# EasyEDA Pro project ProPrj_ProDoc_Board_AI8051U_20240829A_2024-08-30.epro, schematic Schematic_20240829A, sheets 3 to 5 of 6

## Sheets
3 P3
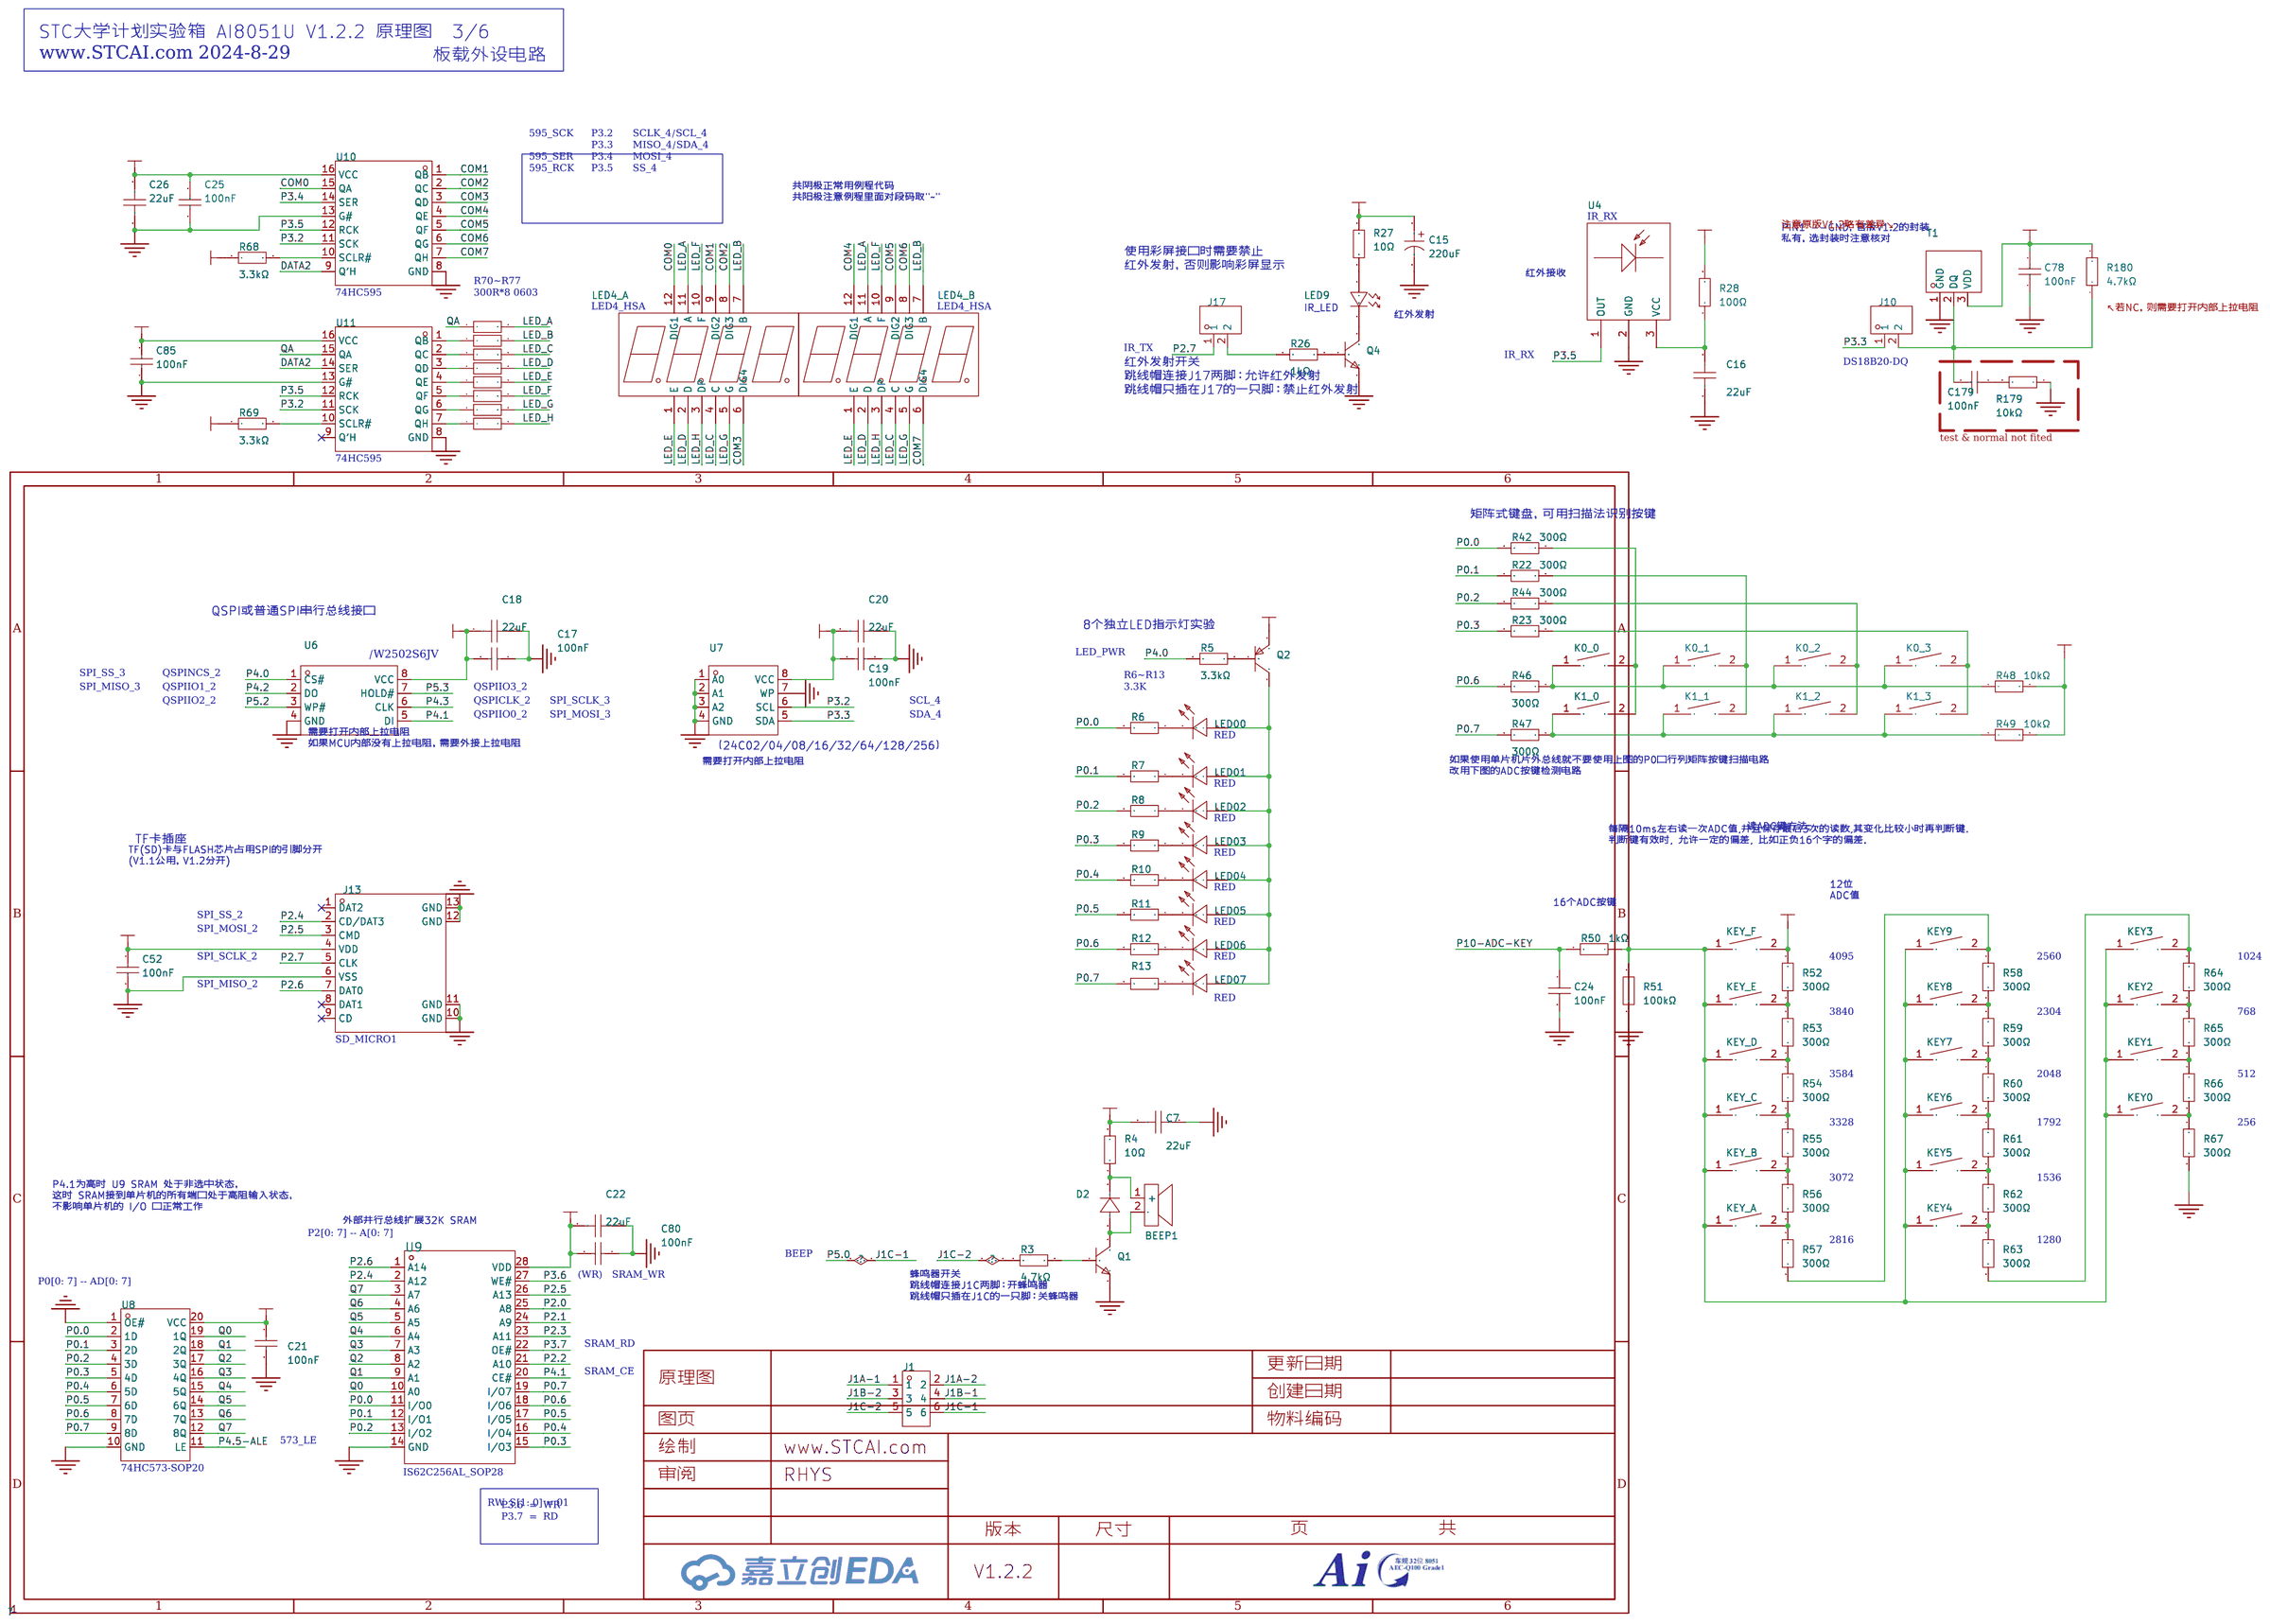
[diagram p2: P3]
4 P4
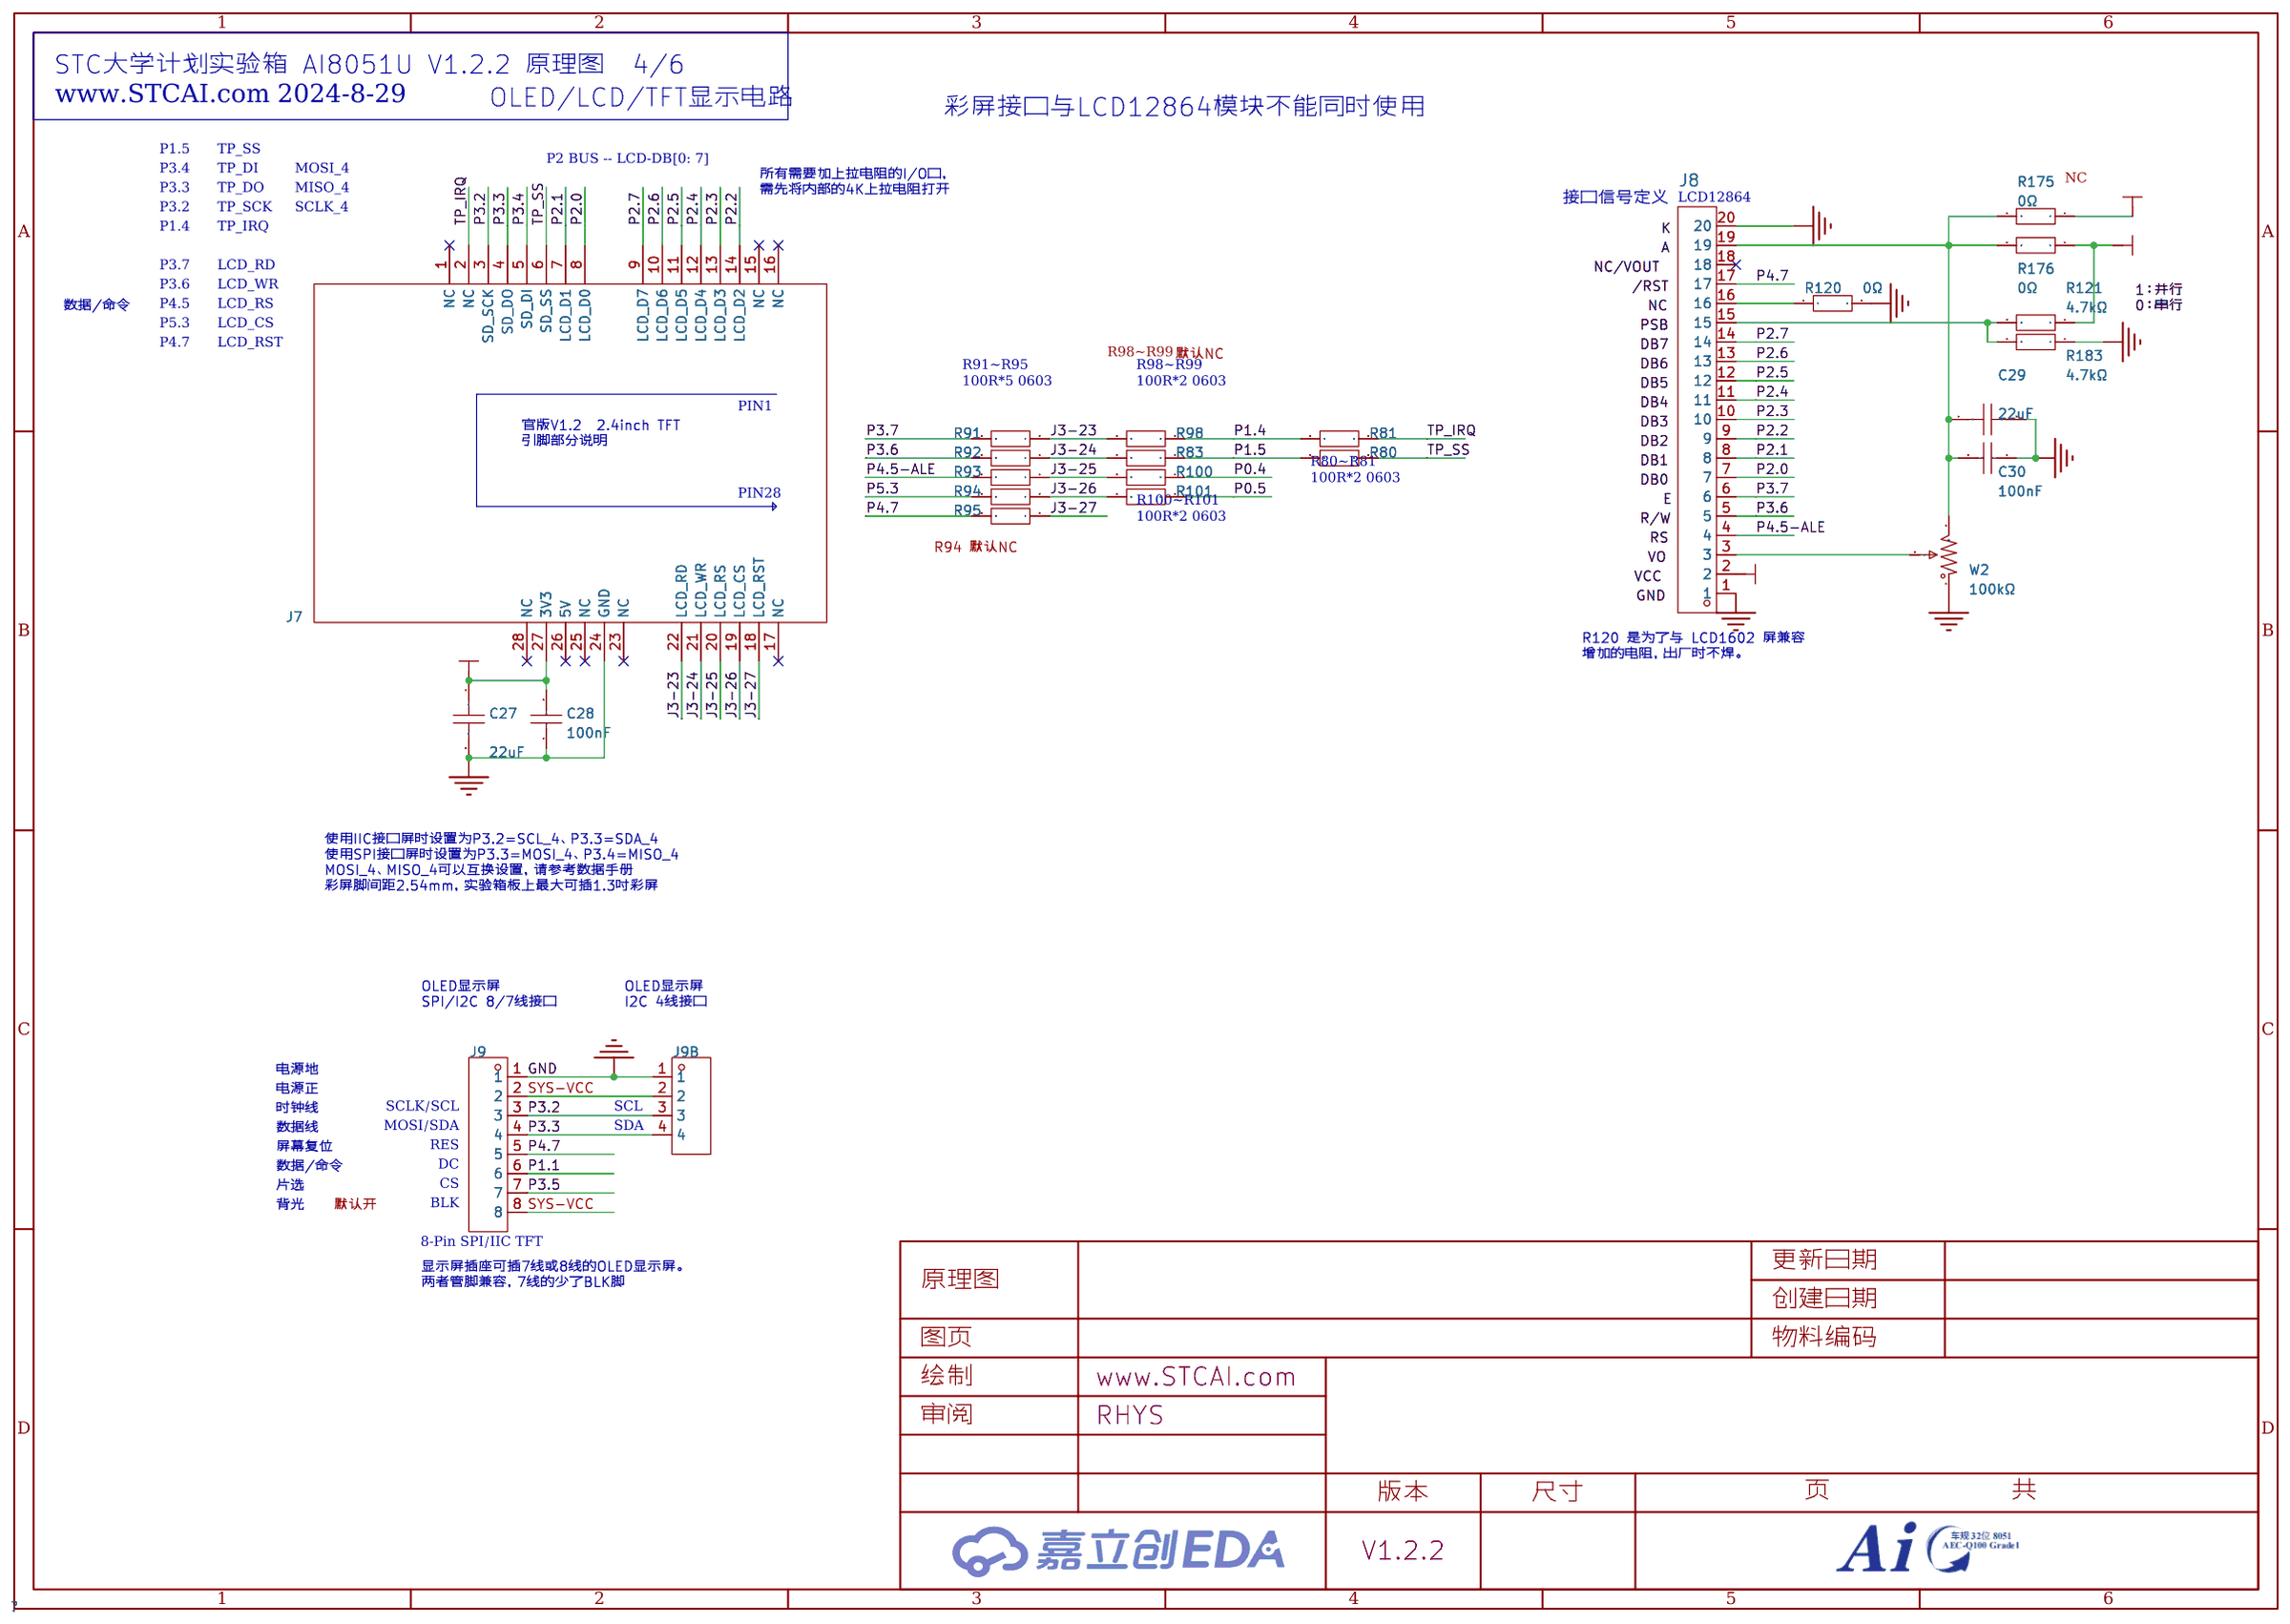
[diagram p3: P4]
5 P5
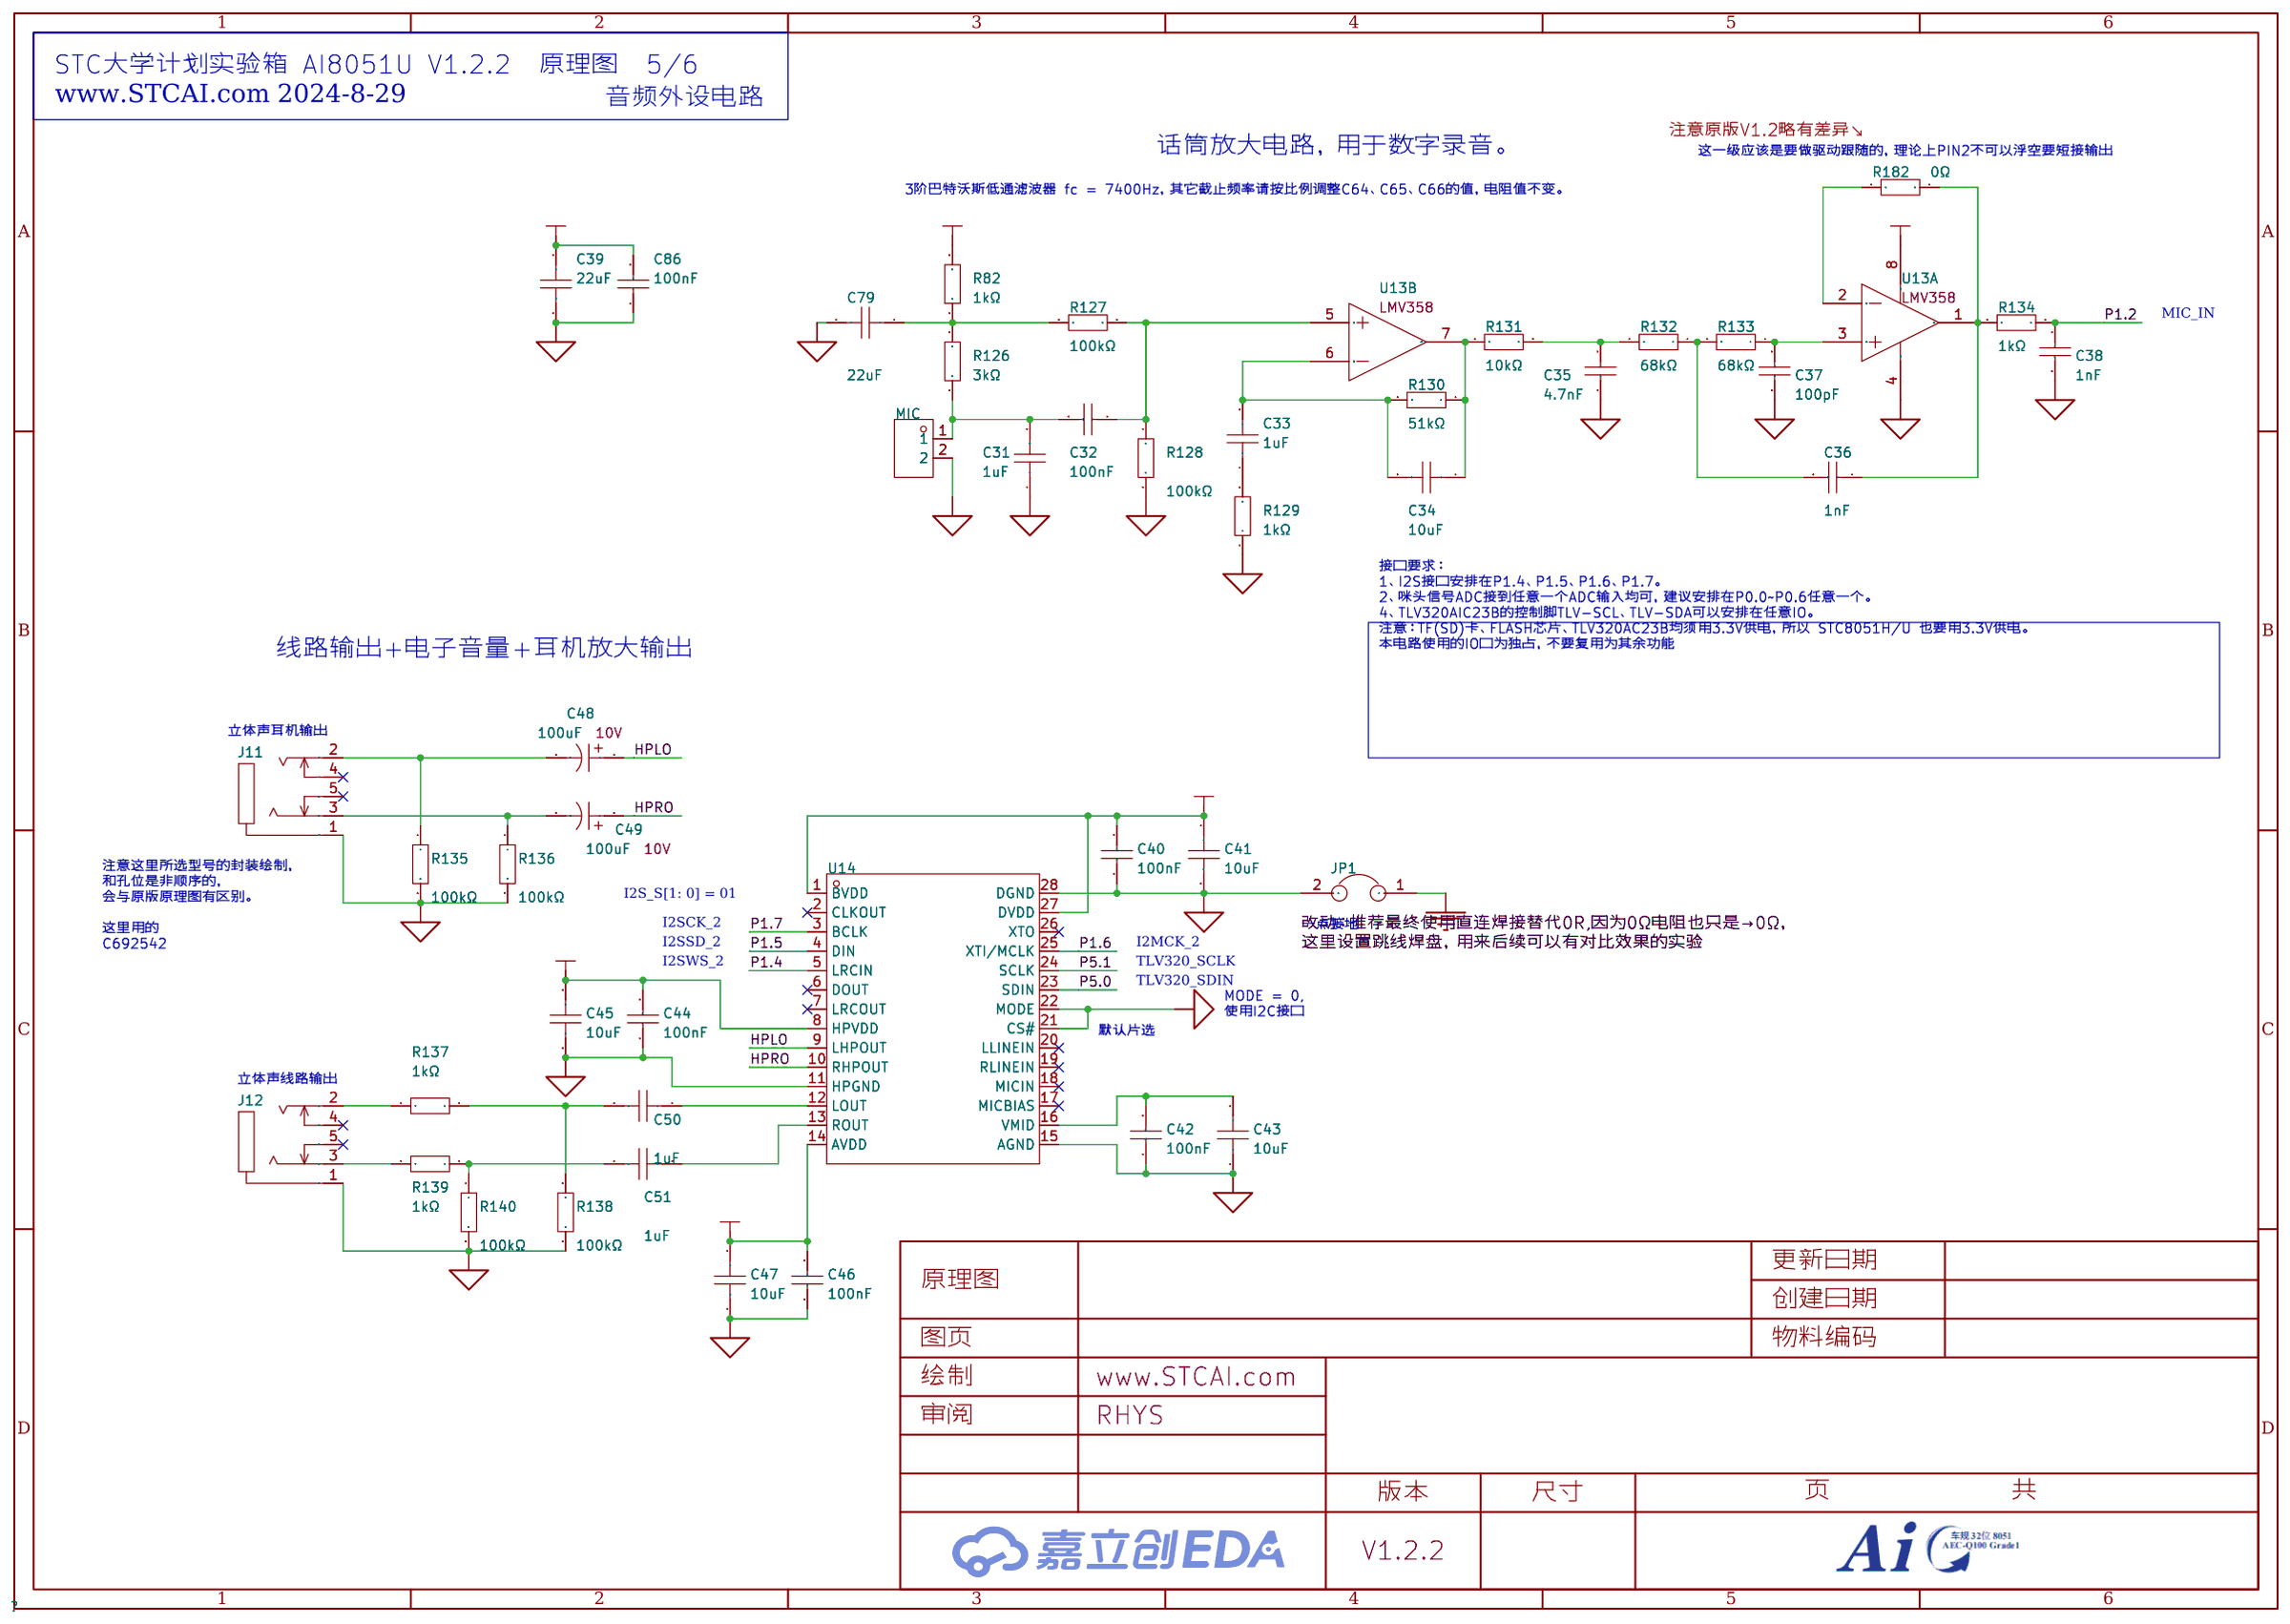
[diagram p4: P5]

## Parts
sheet P3
BEEP1  -  [FP_BEEP_8.5X8.5]
C7  22uF  [C0603]
C15  220uF  [CAP-SMD_BD6.3-L6.6-W6.6-FD]
C16  22uF  [C0603]
C17  100nF  [C0603]
C18  22uF  [C0603]
C19  100nF  [C0603]
C20  22uF  [C0603]
C21  100nF  [C0603]
C22  22uF  [C0603]
C24  100nF  [C0603]
C25  100nF  [C0603]
C26  22uF  [C0603]
C52  100nF  [C0603]
C78  100nF  [C0603]
C80  100nF  [C0603]
C85  100nF  [C0603]
C179  100nF  [C0603]
D2  1N5819WS  [SOD-323_L1.8-W1.3-LS2.5-RD]
J1  PZ254-2-03-S  [HDR-SMD_6P-P2.54-V-M-R2-C3-LS7.5-2]
J10  DZ254S-11-02-50  [HDR-SMD_2P-P2.54-V-M-S4.8_DZ254S-11-02-50]
J13  TF-01A  [TF-SMD_TF-02]
J17  DZ254S-11-02-50  [HDR-SMD_2P-P2.54-V-M-S4.8_DZ254S-11-02-50]
K0_0  TSA363G25-250B  [SW-SMD_L6.1-W3.6-LS8.0]
K0_1  TSA363G25-250B  [SW-SMD_L6.1-W3.6-LS8.0]
K0_2  TSA363G25-250B  [SW-SMD_L6.1-W3.6-LS8.0]
K0_3  TSA363G25-250B  [SW-SMD_L6.1-W3.6-LS8.0]
K1_0  TSA363G25-250B  [SW-SMD_L6.1-W3.6-LS8.0]
K1_1  TSA363G25-250B  [SW-SMD_L6.1-W3.6-LS8.0]
K1_2  TSA363G25-250B  [SW-SMD_L6.1-W3.6-LS8.0]
K1_3  TSA363G25-250B  [SW-SMD_L6.1-W3.6-LS8.0]
KEY0  TSA363G25-250B  [SW-SMD_L6.1-W3.6-LS8.0]
KEY1  TSA363G25-250B  [SW-SMD_L6.1-W3.6-LS8.0]
KEY2  TSA363G25-250B  [SW-SMD_L6.1-W3.6-LS8.0]
KEY3  TSA363G25-250B  [SW-SMD_L6.1-W3.6-LS8.0]
KEY4  TSA363G25-250B  [SW-SMD_L6.1-W3.6-LS8.0]
KEY5  TSA363G25-250B  [SW-SMD_L6.1-W3.6-LS8.0]
KEY6  TSA363G25-250B  [SW-SMD_L6.1-W3.6-LS8.0]
KEY7  TSA363G25-250B  [SW-SMD_L6.1-W3.6-LS8.0]
KEY8  TSA363G25-250B  [SW-SMD_L6.1-W3.6-LS8.0]
KEY9  TSA363G25-250B  [SW-SMD_L6.1-W3.6-LS8.0]
KEY_A  TSA363G25-250B  [SW-SMD_L6.1-W3.6-LS8.0]
KEY_B  TSA363G25-250B  [SW-SMD_L6.1-W3.6-LS8.0]
KEY_C  TSA363G25-250B  [SW-SMD_L6.1-W3.6-LS8.0]
KEY_D  TSA363G25-250B  [SW-SMD_L6.1-W3.6-LS8.0]
KEY_E  TSA363G25-250B  [SW-SMD_L6.1-W3.6-LS8.0]
KEY_F  TSA363G25-250B  [SW-SMD_L6.1-W3.6-LS8.0]
LED00  KT-0603R  [LED0603-RD]
LED01  KT-0603R  [LED0603-RD]
LED02  KT-0603R  [LED0603-RD]
LED03  KT-0603R  [LED0603-RD]
LED04  KT-0603R  [LED0603-RD]
LED4_A  SR410361N  [LED-SEG-TH_12P-L30.0-W14.0-P2.54-S10.26-BL]
LED4_B  SR410361N  [LED-SEG-TH_12P-L30.0-W14.0-P2.54-S10.26-BL]
LED05  KT-0603R  [LED0603-RD]
LED06  KT-0603R  [LED0603-RD]
LED07  KT-0603R  [LED0603-RD]
LED9  IR204-A  [LED-TH_BD4.8-P2.54-FD]
Q1  SS8050  [SOT-23-3_L2.9-W1.3-P1.90-LS2.4-BR]
Q2  SS8550 Y2  [SOT-23-3_L2.9-W1.3-P1.90-LS2.4-BR]
Q4  SS8050  [SOT-23-3_L2.9-W1.3-P1.90-LS2.4-BR]
R3  4.7kΩ  [R0603]
R4  10Ω  [R0603]
R5  3.3kΩ  [R0603]
R6  3.3kΩ  [R0603]
R7  3.3kΩ  [R0603]
R8  3.3kΩ  [R0603]
R9  3.3kΩ  [R0603]
R10  3.3kΩ  [R0603]
R11  3.3kΩ  [R0603]
R12  3.3kΩ  [R0603]
R13  3.3kΩ  [R0603]
R22  300Ω  [R0603]
R23  300Ω  [R0603]
R26  1kΩ  [R0603]
R27  10Ω  [R0603]
R28  100Ω  [R0603]
R42  300Ω  [R0603]
R44  300Ω  [R0603]
R46  300Ω  [R0603]
R47  300Ω  [R0603]
R48  10kΩ  [R0603]
R49  10kΩ  [R0603]
R50  1kΩ  [R0603]
R51  100kΩ  [R0603]
R52  300Ω  [R0603]
R53  300Ω  [R0603]
R54  300Ω  [R0603]
R55  300Ω  [R0603]
R56  300Ω  [R0603]
R57  300Ω  [R0603]
R58  300Ω  [R0603]
R59  300Ω  [R0603]
R60  300Ω  [R0603]
R61  300Ω  [R0603]
R62  300Ω  [R0603]
R63  300Ω  [R0603]
R64  300Ω  [R0603]
R65  300Ω  [R0603]
R66  300Ω  [R0603]
R67  300Ω  [R0603]
R68  3.3kΩ  [R0603]
R69  3.3kΩ  [R0603]
R70  300Ω  [R0603]
R71  300Ω  [R0603]
R72  300Ω  [R0603]
R73  300Ω  [R0603]
R74  300Ω  [R0603]
R75  300Ω  [R0603]
R76  300Ω  [R0603]
R77  300Ω  [R0603]
R179  10kΩ  [R0603]
R180  4.7kΩ  [R0603]
T1  DS18B20  [TO-92-3_L4.9-W3.7-P1.27-L]
U4  IRM-3638T  [OPTO-TH_IRM-3638T]
U6  W25Q80BV  [SOP-8_L5.3-W5.2-P1.27-LS7.9-BL]
U7  AT24C02  [SOP-8_L4.9-W3.9-P1.27-LS6.0-BL]
U8  CD74HC573M96  [SOIC-20_L12.8-W7.5-P1.27-LS10.3-BL]
U9  IS62C256AL-45ULI-TR  [SOIC-28_L17.9-W8.4-P1.27-LS12.7-BL]
U10  74HC595  [SOP-16_L9.9-W3.9-P1.27-LS6.0-BL]
U11  74HC595  [SOP-16_L9.9-W3.9-P1.27-LS6.0-BL]
sheet P4
C27  22uF  [C0603]
C28  100nF  [C0603]
C29  22uF  [C0603]
C30  100nF  [C0603]
J7  -  [RHYS_TEST_N01_Package]
J8  2.54-1*20P直针  [HDR-TH_20P-P2.54-V-M-1]
J9  PZ254V-11-08P  [HDR-TH_8P-P2.54-V-M]
J9B  PZ254V-11-04P  [HDR-TH_4P-P2.54-V-M]
R80  100Ω  [R0603]
R81  100Ω  [R0603]
R83  100Ω  [R0603]
R91  100Ω  [R0603]
R92  100Ω  [R0603]
R93  100Ω  [R0603]
R94  100Ω  [R0603]
R95  100Ω  [R0603]
R98  100Ω  [R0603]
R100  100Ω  [R0603]
R101  100Ω  [R0603]
R120  0Ω  [R0603]
R121  4.7kΩ  [R0603]
R175  0Ω  [R0603]
R176  0Ω  [R0603]
R183  4.7kΩ  [R0603]
W2  100kΩ  [RES-ADJ-TH_3362P]
sheet P5
C31  1uF  [C0603]
C32  100nF  [C0603]
C33  1uF  [C0603]
C34  10uF  [C0603]
C35  4.7nF  [C0603]
C36  1nF  [C0603]
C37  100pF  [C0603]
C38  1nF  [C0603]
C39  22uF  [C0603]
C40  100nF  [C0603]
C41  10uF  [C0603]
C42  100nF  [C0603]
C43  10uF  [C0603]
C44  100nF  [C0603]
C45  10uF  [C0603]
C46  100nF  [C0603]
C47  10uF  [C0603]
C48  100uF  [CAP-SMD_BD6.3-L6.6-W6.6-FD]
C49  100uF  [CAP-SMD_BD6.3-L6.6-W6.6-FD]
C50  1uF  [C0603]
C51  1uF  [C0603]
C79  22uF  [C0603]
C86  100nF  [C0603]
J11  PJ-307N5  [AUDIO-TH_PJ-307N5]
J12  PJ-307N5  [AUDIO-TH_PJ-307N5]
JP1  JUMPER  [JUMPER-0603]
MIC  BX-XH2.54-2PZZ  [CONN-TH_2P-P2.50_BX-XH2.54-2PZZ]
R82  1kΩ  [R0603]
R126  3kΩ  [R0603]
R127  100kΩ  [R0603]
R128  100kΩ  [R0603]
R129  1kΩ  [R0603]
R130  51kΩ  [R0603]
R131  10kΩ  [R0603]
R132  68kΩ  [R0603]
R133  68kΩ  [R0603]
R134  1kΩ  [R0603]
R135  100kΩ  [R0603]
R136  100kΩ  [R0603]
R137  1kΩ  [R0603]
R138  100kΩ  [R0603]
R139  1kΩ  [R0603]
R140  100kΩ  [R0603]
R182  0Ω  [R0603]
U13  LMV358  [SOP-8_L4.9-W3.9-P1.27-LS6.0-BL]  (sections 1,2)
U14  TLV320AIC23BIPWR  [TSSOP-28_L9.7-W4.4-P0.65-LS6.4-BL]

## Library data of the parts
BEEP1 = BEEP_8.5X8.5
C7 C16 C18 C20 C22 C26 C27 C29 C39 C79 = CL10A226MO7JZNC: 容值:22uF;精度:±20%;额定电压:16V;材质(温度系数):X5R;; LCSC Part Name: 22uF ±20% 16V; Supplier Part: C2762594; Manufacturer: SAMSUNG(三星); Supplier Footprint: 0603; JLCPCB Part Class: 扩展库; Datasheet: https://atta.szlcsc.com/upload/public/pdf/source/20220811/0832C3B1C642040B023B7A6186895861.pdf; Supplier: LCSC; Tolerance: ±20%; Voltage Rated: 16V; Temperature Coefficient: X5R
C15 = RVT220UF16V67RV0015: 容值:220uF;精度:±20%;额定电压:16V;纹波电流:110mA@120Hz;等效串联电阻:-;; LCSC Part Name: 220uF ±20% 16V; Supplier Part: C2887273; Manufacturer: KNSCHA(科尼盛); Supplier Footprint: SMD,D6.3xL7.7mm; JLCPCB Part Class: 扩展库; Datasheet: https://atta.szlcsc.com/upload/public/pdf/source/20210824/3DC9999D9B098FE241E3A26137981C4C.pdf; Supplier: LCSC; Tolerance: ±20%; Rated Voltage: 16V; Ripple Current: 110mA@120Hz; φD: 6.3mm; L: 7.7mm; Lifetime @ Temp: 2000hrs@105℃; Operating Temperature: -55℃~+105℃
C17 C19 C21 C24 C25 C28 C30 C32 C40 C42 C44 C46 C52 C78 C80 C85 C86 C179 = CL10B104KO8NNNC: 容值:100nF;精度:±10%;额定电压:16V;材质(温度系数):X7R;; LCSC Part Name: 100nF ±10% 16V; Supplier Part: C66501; Manufacturer: SAMSUNG(三星); Supplier Footprint: 0603; JLCPCB Part Class: 扩展库; Datasheet: https://atta.szlcsc.com/upload/public/pdf/source/20160218/1457707763339.pdf; Supplier: LCSC; Tolerance: ±10%; Voltage Rated: 16V; Temperature Coefficient: X7R
D2 = 1N5819WS_C5451629: 二极管配置:独立式;正向压降(Vf):600mV@200mA;直流反向耐压(Vr):40V;平均整流电流(Io):350mA;; LCSC Part Name: 电压:40V 电流:350mA; Supplier Part: C5451629; Manufacturer: HXY MOSFET(华轩阳电子); Supplier Footprint: SOD-323; JLCPCB Part Class: 扩展库; Datasheet: https://atta.szlcsc.com/upload/public/pdf/source/20230718/7C7F3D76618DEFA6683A9DF9E80B45F1.pdf; Supplier: LCSC; Diode Configuration: 独立式; Forward Voltage (Vf@If): 600mV@200mA; Reverse Voltage (Vr): 40V; Average Rectified Current (Io): 350mA; Reverse Leakage Current (Ir): 5uA@30V
J1 = PZ254-2-03-S: 插针结构:2x3P;间距:2.54mm;行距:2.54mm;圆针/方针:方针;安装类型:立贴;排数:双排;总PIN位数:6P;额定电流:3A;额定电压:250V;配合针长度:6mm;塑高:2.5mm;端接针长度:-;工作温度范围:-40℃~+105℃;焊接温度(最大值):260℃@5S;颜色:黑色;; LCSC Part Name: 2x3P 间距:2.54mm 方针 立贴 黑色; Supplier Part: C3294461; Manufacturer: HCTL(华灿天禄); Supplier Footprint: SMD,P=2.54mm; JLCPCB Part Class: 扩展库; Datasheet: https://atta.szlcsc.com/upload/public/pdf/source/20230609/FB2B5B924AA338E6CB93C3BD1D012B72.pdf; Supplier: LCSC; Pin Structure: 2x3P; Pitch: 2.54mm; Row Spacing: 2.54mm; Circluar Pins/Square Pins: 方针; Mounting Type: 立贴; Number of Rows: 双排; Number of Pins: 6P; Current Rating (Max): 3A; Voltage Rating (Max): 250V; Length of Mating Pin: 6mm; Insulation Height: 2.5mm; Operating Temperature Range: -40℃~+105℃; Soldering Temperature(Max): 260℃@5S; Color: 黑色
J10 J17 = DZ254S-11-02-50: 插针结构:1x2P;间距:2.54mm;圆针/方针:方针;安装类型:立贴;; LCSC Part Name: 间距:2.54mm 1x2P 立贴 方针; Supplier Part: C17702633; Manufacturer: DEALON(德艺隆); Supplier Footprint: SMD,P=2.54mm(交错脚); JLCPCB Part Class: 扩展库; Datasheet: https://atta.szlcsc.com/upload/public/pdf/source/20230913/ABC6E3C99A1E0EED00221BCE3DC8DD21.pdf; Supplier: LCSC; Pin Structure: 1x2P; Pitch: 2.54mm; Circluar Pins/Square Pins: 方针; Mounting Type: 立贴
J13 = TF-01A_C2889258: 卡连接方式:自弹式;卡类型:MicroSD卡(TF卡);连接器类型:卡座;本体最大高度:2mm;工作温度范围:-;; LCSC Part Name: 自弹式 MicroSD卡(TF卡) 卡座; Supplier Part: C2889258; Manufacturer: Yuandi(元迪); Supplier Footprint: SMD; JLCPCB Part Class: 扩展库; Datasheet: https://atta.szlcsc.com/upload/public/pdf/source/20210830/44259D2B93BF4B637A446EF1520C4989.pdf; Supplier: LCSC; Card Connection Mode: 自弹式; Card Type: MicroSD卡(TF卡); Connector Type: 卡座; Maximum Body Height: 2mm
K0_0-K0_3 K1_0-K1_3 KEY0-KEY9 KEY_A KEY_B KEY_C KEY_D KEY_E KEY_F = TSA363G25-250B: 电路结构:单刀单掷;按钮形状:矩形按钮;作用力:250gf;安装方式:立贴;开关长度:6.05mm;开关宽度:3.6mm;开关高度:2.5mm;带支架:不带;触点电流:50mA;额定电压(DC):12V;绝缘电阻:100MΩ;带灯:无;机械寿命:5万次;; LCSC Part Name: 6.05*3.6*2.5mm 立贴 轻触开关; Supplier Part: C354943; Manufacturer: BRIGHT(博瑞泰); Supplier Footprint: SMD; JLCPCB Part Class: 扩展库; Datasheet: https://atta.szlcsc.com/upload/public/pdf/source/20190426/C354943_F8D02988919B0D3B4D493E3C3D798834.pdf; Supplier: LCSC; Circuit: 单刀单掷; Actuator Style: 矩形按钮; Operating Force: 250gf; Mounting Style: 立贴; Switch Length: 6.05mm; Switch Width: 3.6mm; Switch Height: 2.5mm; Strike Gundam: 不带; Contact Current: 50mA; Voltage Rating (DC): 12V; Insulation Resistance: 100MΩ; Actuator/Cap Color: 白色; With Lamp: 无; Pin Style: 鸥翼型; Mechanical Life: 5万次; Operating Temperature: -25℃~+70℃
LED00 LED01 LED02 LED03 LED04 LED05 LED06 LED07 = KT-0603R: 发光颜色:红色;功率:-;正向电流:-;主波长:-;二极管配置:-;透镜颜色:-;色温:-;发光角度:-;载带方式:-;工作温度:-40℃~+85℃;; LCSC Part Name: 0603 红灯 高亮; Supplier Part: C2286; Manufacturer: KENTO; Supplier Footprint: 0603; JLCPCB Part Class: 基础库; Datasheet: https://atta.szlcsc.com/upload/public/pdf/source/20160616/1466072038404.pdf; Supplier: LCSC; Emitted Color: 红色; Operating Temperature: -40℃~+85℃
LED4_A LED4_B = SR410361N: 数码管位数:4位;发光颜色:红色;LED极性:共阳极;数字/字母大小(英寸):0.36;; LCSC Part Name: 4位0.36英寸红色数码管 共阳极; Supplier Part: C132660; Manufacturer: ARKLED(方舟); Supplier Footprint: 插件; JLCPCB Part Class: 扩展库; Datasheet: https://atta.szlcsc.com/upload/public/pdf/source/20171014/C132660_15079754140001038126.pdf; Supplier: LCSC; Number of Characters: 4位; Luminous Color: 红色; LED Polarity: 共阳极; Digit/Alpha Size(inch): 0.36
LED9 = IR204-A: 正向电压:1.2V;波长:940nm;辐射强度:4mW/sr@20mA;视角:35°;; Supplier Part: C264278; Manufacturer: EVERLIGHT(亿光); Supplier Footprint: 插件,D=3mm; JLCPCB Part Class: 扩展库; Datasheet: https://atta.szlcsc.com/upload/public/pdf/source/20180817/C264278_A3541EC50ECB044DA697B7274F817B27.pdf; Supplier: LCSC; Vf - Forward Voltage: 1.2V; Wavelength: 940nm; Radiant Intensity: 4mW/sr@20mA; View Angle: 35°; Operating Temperature: -40℃~+85℃
Q1 Q4 = SS8050_C2150: 晶体管类型:NPN;集电极电流(Ic):1.5A;集射极击穿电压(Vceo):25V;功率(Pd):300mW;直流电流增益(hFE@Ic,Vce):200@100mA,1V;; LCSC Part Name: SS8050(RANGE:200-350) hfe=200~350; Supplier Part: C2150; Manufacturer: CJ(江苏长电/长晶); Supplier Footprint: SOT-23; JLCPCB Part Class: 基础库; Datasheet: https://atta.szlcsc.com/upload/public/pdf/source/20230322/AEE86F4B043774EFF80CAEA14A37D9E9.pdf; Supplier: LCSC; Transistor Type: NPN; Collector Current (Ic): 1.5A; Collector-Emitter Breakdown Voltage (Vceo): 25V; Power Dissipation (Pd): 300mW; DC Current Gain (hFE@Ic,Vce): 200@100mA,1V; Transition Frequency (fT): 100MHz; Collector Cut-Off Current (Icbo): 100nA; Collector-Emitter Saturation Voltage (VCE(sat)@Ic,Ib): 500mV@800mA,80mA
Q2 = SS8550 Y2: 晶体管类型:PNP;集电极电流(Ic):1.5A;集射极击穿电压(Vceo):25V;功率(Pd):300mW;直流电流增益(hFE@Ic,Vce):200@100mA,1V;; LCSC Part Name: SS8550 Y2(RANGE:200-350) hfe=200~350; Supplier Part: C8542; Manufacturer: CJ(江苏长电/长晶); Supplier Footprint: SOT-23; JLCPCB Part Class: 基础库; Datasheet: https://atta.szlcsc.com/upload/public/pdf/source/20140809/1457707214734.pdf; Supplier: LCSC; Transistor Type: PNP; Collector Current (Ic): 1.5A; Collector-Emitter Breakdown Voltage (Vceo): 25V; Power Dissipation (Pd): 300mW; DC Current Gain (hFE@Ic,Vce): 200@100mA,1V; Transition Frequency (fT): 100MHz; Collector Cut-Off Current (Icbo): 100nA; Collector-Emitter Saturation Voltage (VCE(sat)@Ic,Ib): 500mV@800mA,80mA
R3 R121 R180 R183 = 0603WAF4701T5E: 电阻类型:厚膜电阻;阻值:4.7kΩ;精度:±1%;功率:100mW;最大工作电压:75V;温度系数:±100ppm/℃;; LCSC Part Name: 4.7kΩ ±1% 100mW 厚膜电阻; Supplier Part: C23162; Manufacturer: UNI-ROYAL(厚声); Supplier Footprint: 0603; JLCPCB Part Class: 基础库; Datasheet: https://atta.szlcsc.com/upload/public/pdf/source/20200306/C422600_1E6D84923E4A46A82E41ADD87F860B5C.pdf; Supplier: LCSC; Type: 厚膜电阻; Tolerance: ±1%; Power(Watts): 100mW; Overload Voltage (Max): 75V; Temperature Coefficient: ±100ppm/℃; Operating Temperature Range: -55℃~+155℃
R4 R27 = 0603WAF100JT5E: 电阻类型:厚膜电阻;阻值:10Ω;精度:±1%;功率:100mW;最大工作电压:75V;温度系数:±400ppm/℃;; LCSC Part Name: 10Ω ±1% 100mW 厚膜电阻; Supplier Part: C22859; Manufacturer: UNI-ROYAL(厚声); Supplier Footprint: 0603; Datasheet: https://atta.szlcsc.com/upload/public/pdf/source/20200306/C422600_1E6D84923E4A46A82E41ADD87F860B5C.pdf; Supplier: LCSC; Type: 厚膜电阻; Tolerance: ±1%; Power(Watts): 100mW; Overload Voltage (Max): 75V; Temperature Coefficient: ±400ppm/℃; Operating Temperature Range: -55℃~+155℃
R5-R13 R68 R69 = 0603WAF3301T5E: 电阻类型:厚膜电阻;阻值:3.3kΩ;精度:±1%;功率:100mW;最大工作电压:75V;温度系数:±100ppm/℃;; LCSC Part Name: 3.3kΩ ±1% 100mW 厚膜电阻; Supplier Part: C22978; Manufacturer: UNI-ROYAL(厚声); Supplier Footprint: 0603; JLCPCB Part Class: 基础库; Datasheet: https://atta.szlcsc.com/upload/public/pdf/source/20200306/C422600_1E6D84923E4A46A82E41ADD87F860B5C.pdf; Supplier: LCSC; Type: 厚膜电阻; Tolerance: ±1%; Power(Watts): 100mW; Overload Voltage (Max): 75V; Temperature Coefficient: ±100ppm/℃; Operating Temperature Range: -55℃~+155℃
R22 R23 R42 R44 R46 R47 R52-R67 R70-R77 = 0603WAF3000T5E: 电阻类型:厚膜电阻;阻值:300Ω;精度:±1%;功率:100mW;最大工作电压:75V;温度系数:±100ppm/℃;; LCSC Part Name: 300Ω ±1% 100mW 厚膜电阻; Supplier Part: C23025; Manufacturer: UNI-ROYAL(厚声); Supplier Footprint: 0603; JLCPCB Part Class: 基础库; Datasheet: https://atta.szlcsc.com/upload/public/pdf/source/20200306/C422600_1E6D84923E4A46A82E41ADD87F860B5C.pdf; Supplier: LCSC; Type: 厚膜电阻; Tolerance: ±1%; Power(Watts): 100mW; Overload Voltage (Max): 75V; Temperature Coefficient: ±100ppm/℃; Operating Temperature Range: -55℃~+155℃
R26 R50 R82 R129 R134 R137 R139 = 0603WAF1001T5E: 电阻类型:厚膜电阻;阻值:1kΩ;精度:±1%;功率:100mW;最大工作电压:75V;温度系数:±100ppm/℃;; LCSC Part Name: 1kΩ ±1% 100mW 厚膜电阻; Supplier Part: C21190; Manufacturer: UNI-ROYAL(厚声); Supplier Footprint: 0603; JLCPCB Part Class: 基础库; Datasheet: https://atta.szlcsc.com/upload/public/pdf/source/20200306/C422600_1E6D84923E4A46A82E41ADD87F860B5C.pdf; Supplier: LCSC; Type: 厚膜电阻; Tolerance: ±1%; Power(Watts): 100mW; Overload Voltage (Max): 75V; Temperature Coefficient: ±100ppm/℃; Operating Temperature Range: -55℃~+155℃
R28 R80 R81 R83 R91-R95 R98 R100 R101 = 0603WAF1000T5E: 电阻类型:厚膜电阻;阻值:100Ω;精度:±1%;功率:100mW;最大工作电压:75V;温度系数:±200ppm/℃;; LCSC Part Name: 100Ω ±1% 100mW 厚膜电阻; Supplier Part: C22775; Manufacturer: UNI-ROYAL(厚声); Supplier Footprint: 0603; JLCPCB Part Class: 基础库; Datasheet: https://atta.szlcsc.com/upload/public/pdf/source/20200306/C422600_1E6D84923E4A46A82E41ADD87F860B5C.pdf; Supplier: LCSC; Type: 厚膜电阻; Tolerance: ±1%; Power(Watts): 100mW; Overload Voltage (Max): 75V; Temperature Coefficient: ±200ppm/℃; Operating Temperature Range: -55℃~+155℃
R48 R49 R131 R179 = 0603WAF1002T5E: 电阻类型:厚膜电阻;阻值:10kΩ;精度:±1%;功率:100mW;最大工作电压:75V;温度系数:±100ppm/℃;; LCSC Part Name: 厚膜电阻 10kΩ ±1% 100mW; Supplier Part: C25804; Manufacturer: UNI-ROYAL(厚声); Supplier Footprint: 0603; JLCPCB Part Class: 基础库; Datasheet: https://atta.szlcsc.com/upload/public/pdf/source/20200306/C422600_1E6D84923E4A46A82E41ADD87F860B5C.pdf; Supplier: LCSC; Type: 厚膜电阻; Tolerance: ±1%; Power(Watts): 100mW; Overload Voltage (Max): 75V; Temperature Coefficient: ±100ppm/℃; Operating Temperature Range: -55℃~+155℃
R51 R127 R128 R135 R136 R138 R140 = 0603WAF1003T5E: 电阻类型:厚膜电阻;阻值:100kΩ;精度:±1%;功率:100mW;最大工作电压:75V;温度系数:±100ppm/℃;; LCSC Part Name: 100kΩ ±1% 100mW 厚膜电阻; Supplier Part: C25803; Manufacturer: UNI-ROYAL(厚声); Supplier Footprint: 0603; JLCPCB Part Class: 基础库; Datasheet: https://atta.szlcsc.com/upload/public/pdf/source/20200306/C422600_1E6D84923E4A46A82E41ADD87F860B5C.pdf; Supplier: LCSC; Type: 厚膜电阻; Tolerance: ±1%; Power(Watts): 100mW; Overload Voltage (Max): 75V; Temperature Coefficient: ±100ppm/℃; Operating Temperature Range: -55℃~+155℃
T1 = DS18B20: 温度范围:-55℃~+125℃;精度:±0.4℃;接口类型:-;; Supplier Part: C376006; Manufacturer: UMW(友台半导体); Supplier Footprint: TO-92; JLCPCB Part Class: 扩展库; Datasheet: https://atta.szlcsc.com/upload/public/pdf/source/20231109/DC3DA9D47D486EF40A6E0F08B9A498E3.pdf; Supplier: LCSC; Temperature range: -55℃~+125℃; Resolution: ±0.4℃; Supply Voltage: 3V~5.5V
U4 = IRM-3638T: 工作电压:2.7V~5.5V;工作电流:450uA;接收距离:6m;中心频率:38kHz;接收角度:±35°@垂直；±35°@水平;; LCSC Part Name: 接收距离6m ±35°@水平 ±35°@垂直; Supplier Part: C16216; Manufacturer: EVERLIGHT(亿光); Supplier Footprint: SIP-3-2.54mm; JLCPCB Part Class: 扩展库; Datasheet: https://atta.szlcsc.com/upload/public/pdf/source/20220214/1DCBCED37080C09F6BD0084BAB4DFEE5.pdf; Supplier: LCSC; Supply Voltage: 2.7V~5.5V; Supply Current: 450uA; Transmission Distance: 6m; Center Frequency: 38kHz; Half Angle: ±35°@垂直；±35°@水平; Operating Temperature: -20℃~+80℃
U6 = W25Q80BV: Supplier Part: C9900000673; Supplier Footprint: SOP-8-208mil; JLCPCB Part Class: 扩展库; Supplier: LCSC
U7 = AT24C02_C7470930: 接口类型:I2C;存储容量:2Kbit;时钟频率(fc):400kHz~1MHz;; LCSC Part Name: AT24C02  2Kbit 12C; Supplier Part: C7470930; Manufacturer: HXY MOSFET(华轩阳电子); Supplier Footprint: SOP-8; JLCPCB Part Class: 扩展库; Datasheet: https://atta.szlcsc.com/upload/public/pdf/source/20230913/748AF0FF0068DF582FAC58AD968E8A28.pdf; Supplier: LCSC; Interface Type: I2C; Memory Size: 2Kbit; Clock Frequency (fc): 400kHz~1MHz; Supply Voltage: 1.8V~5.5V; Data Retention - TDR (Year): 100年
U8 = CD74HC573M96: 逻辑类型:-;; Supplier Part: C2652973; Manufacturer: TI(德州仪器); Supplier Footprint: SOIC-20-300mil; JLCPCB Part Class: 扩展库; Datasheet: https://www.ti.com/cn/lit/gpn/cd74hc573; Supplier: LCSC
U9 = IS62C256AL-45ULI-TR: 256-Kbit(32K x 8bit)，并行接口，工作电压：5V; Supplier Part: C14323; Manufacturer: ISSI(美国芯成); Supplier Footprint: SOIC-28-8.4mm; JLCPCB Part Class: 扩展库; Datasheet: https://atta.szlcsc.com/upload/public/pdf/source/20130627/1457706619119.pdf; Supplier: LCSC
U10 U11 = 74HC595: 功能:串行至串行或并行;电源电压:2V~6V;元件数:1;每个元件位数:8;; Supplier Part: C18164493; Manufacturer: GR(国睿); Supplier Footprint: SOP-16; JLCPCB Part Class: 扩展库; Datasheet: https://atta.szlcsc.com/upload/public/pdf/source/20230915/F264A7C02E418D1689E15579DAA93EB8.pdf; Supplier: LCSC; Function: 串行至串行或并行; Supply Voltage: 2V~6V; Number of Elements: 1; Number of Bits per Element: 8; Output Type: 三态; Series: 74HC; Operating Temperature: -40℃~+85℃
J7 = RHYS_TEST_N01
J8 = 2.54-1*20P直针: 插针结构:1x20P;间距:2.54mm;行距:-;圆针/方针:方针;安装类型:直插;排数:单排;总PIN位数:20P;额定电流:3A;额定电压:-;配合针长度:-;塑高:-;端接针长度:-;触头材质:黄铜;触头镀层:-;工作温度范围:-40℃~+105℃;颜色:黑色;; LCSC Part Name: 间距:2.54mm 1x20P 直插 方针; Supplier Part: C50981; Manufacturer: BOOMELE(博穆精密); Supplier Footprint: 插件,P=2.54mm; JLCPCB Part Class: 扩展库; Datasheet: https://atta.szlcsc.com/upload/public/pdf/source/20151109/1457707572883.pdf; Supplier: LCSC; Pin Structure: 1x20P; Pitch: 2.54mm; Circluar Pins/Square Pins: 方针; Mounting Type: 直插; Number of Rows: 单排; Number of Pins: 20P; Current Rating (Max): 3A; Contact Material: 黄铜; Operating Temperature Range: -40℃~+105℃; Color: 黑色
J9 = PZ254V-11-08P: 插针结构:1x8P;间距:2.54mm;行距:-;圆针/方针:方针;安装类型:直插;排数:单排;总PIN位数:8P;额定电流:-;额定电压:-;配合针长度:6mm;塑高:2.5mm;端接针长度:3mm;触头材质:黄铜;触头镀层:-;工作温度范围:-40℃~+105℃;颜色:黑色;; LCSC Part Name: 间距:2.54mm 1x8P 直插 方针; Supplier Part: C492407; Manufacturer: XFCN(兴飞); Supplier Footprint: 插件,P=2.54mm; JLCPCB Part Class: 扩展库; Datasheet: https://atta.szlcsc.com/upload/public/pdf/source/20200309/C492407_83A6FB26A2233368EDB9516968EC6149.pdf; Supplier: LCSC; Pin Structure: 1x8P; Pitch: 2.54mm; Circluar Pins/Square Pins: 方针; Mounting Type: 直插; Number of Rows: 单排; Number of Pins: 8P; Length of Mating Pin: 6mm; Insulation Height: 2.5mm; Length of End Connection Pin: 3mm; Contact Material: 黄铜; Operating Temperature Range: -40℃~+105℃; Color: 黑色
J9B = PZ254V-11-04P: 插针结构:1x4P;间距:2.54mm;行距:-;圆针/方针:方针;安装类型:直插;排数:单排;总PIN位数:4P;额定电流:3A;额定电压:250V;配合针长度:6mm;塑高:2.5mm;端接针长度:3mm;触头材质:-;工作温度范围:-40℃~+105℃;颜色:黑色;; LCSC Part Name: 间距:2.54mm 1x4P 直插 方针; Supplier Part: C2691448; Manufacturer: XFCN(兴飞); Supplier Footprint: 插件,P=2.54mm; JLCPCB Part Class: 扩展库; Datasheet: https://atta.szlcsc.com/upload/public/pdf/source/20200309/C492403_F9F19131791D08044AD4F84F8E751A34.pdf; Supplier: LCSC; Pin Structure: 1x4P; Pitch: 2.54mm; Circluar Pins/Square Pins: 方针; Mounting Type: 直插; Number of Rows: 单排; Number of Pins: 4P; Current Rating (Max): 3A; Voltage Rating (Max): 250V; Length of Mating Pin: 6mm; Insulation Height: 2.5mm; Length of End Connection Pin: 3mm; Operating Temperature Range: -40℃~+105℃; Color: 黑色
R120 R175 R176 R182 = 0603WAF0000T5E: 电阻类型:厚膜电阻;阻值:0Ω;精度:±1%;功率:100mW;最大工作电压:75V;; LCSC Part Name: 0Ω ±1% 100mW 厚膜电阻; Supplier Part: C21189; Manufacturer: UNI-ROYAL(厚声); Supplier Footprint: 0603; JLCPCB Part Class: 基础库; Datasheet: https://atta.szlcsc.com/upload/public/pdf/source/20200306/C422600_1E6D84923E4A46A82E41ADD87F860B5C.pdf; Supplier: LCSC; Type: 厚膜电阻; Tolerance: ±1%; Power(Watts): 100mW; Overload Voltage (Max): 75V; Operating Temperature Range: -55℃~+155℃
W2 = 3362P-1-104: 阻值:100kΩ;精度:±10%;; LCSC Part Name: 100kΩ ±10%; Supplier Part: C118966; Manufacturer: BOCHEN(博晨); Supplier Footprint: 插件; JLCPCB Part Class: 扩展库; Datasheet: https://atta.szlcsc.com/upload/public/pdf/source/20171114/C118966_15106326666201117452.pdf; Supplier: LCSC; Tolerance: ±10%
C31 C33 C50 C51 = CL10A105KB8NNNC: 容值:1uF;精度:±10%;额定电压:50V;材质(温度系数):X5R;; LCSC Part Name: 1uF ±10% 50V; Supplier Part: C15849; Manufacturer: SAMSUNG(三星); Supplier Footprint: 0603; Datasheet: https://atta.szlcsc.com/upload/public/pdf/source/20160218/1457707763339.pdf; Supplier: LCSC; Tolerance: ±10%; Voltage Rated: 50V; Temperature Coefficient: X5R
C34 C41 C43 C45 C47 = CL10A106KP8NNNC: 容值:10uF;精度:±10%;额定电压:10V;材质(温度系数):X5R;; LCSC Part Name: 10uF ±10% 10V; Supplier Part: C19702; Manufacturer: SAMSUNG(三星); Supplier Footprint: 0603; Datasheet: https://atta.szlcsc.com/upload/public/pdf/source/20160218/1457707763339.pdf; Supplier: LCSC; Tolerance: ±10%; Voltage Rated: 10V; Temperature Coefficient: X5R
C35 = 0603B472K500NT: 容值:4.7nF;精度:±10%;额定电压:50V;材质(温度系数):X7R;; LCSC Part Name: 4.7nF ±10% 50V; Supplier Part: C53987; Manufacturer: FH(风华); Supplier Footprint: 0603; Datasheet: https://atta.szlcsc.com/upload/public/pdf/source/20200305/C486355_26A10D38EF8C2A5C37091D0039909270.pdf; Supplier: LCSC; Tolerance: ±10%; Voltage Rated: 50V; Temperature Coefficient: X7R
C36 C38 = CL10B102KB8NNNC: 容值:1nF;精度:±10%;额定电压:50V;材质(温度系数):X7R;; LCSC Part Name: 1nF ±10% 50V; Supplier Part: C1588; Manufacturer: SAMSUNG(三星); Supplier Footprint: 0603; JLCPCB Part Class: 基础库; Datasheet: https://atta.szlcsc.com/upload/public/pdf/source/20160218/1457707763339.pdf; Supplier: LCSC; Tolerance: ±10%; Voltage Rated: 50V; Temperature Coefficient: X7R
C37 = CL10C101JB8NNNC: 容值:100pF;精度:±5%;额定电压:50V;材质(温度系数):C0G;; LCSC Part Name: 100pF ±5% 50V; Supplier Part: C14858; Manufacturer: SAMSUNG(三星); Supplier Footprint: 0603; JLCPCB Part Class: 基础库; Datasheet: https://atta.szlcsc.com/upload/public/pdf/source/20160218/1457707763339.pdf; Supplier: LCSC; Tolerance: ±5%; Voltage Rated: 50V; Temperature Coefficient: C0G
C48 C49 = RVT220UF16V67RV0015: 容值:220uF;精度:±20%;额定电压:16V;纹波电流:110mA@120Hz;等效串联电阻:-;; LCSC Part Name: 220uF ±20% 16V; Supplier Part: C2887273; Manufacturer: KNSCHA(科尼盛); Supplier Footprint: SMD,D6.3xL7.7mm; JLCPCB Part Class: 扩展库; Datasheet: https://atta.szlcsc.com/upload/public/pdf/source/20210824/3DC9999D9B098FE241E3A26137981C4C.pdf; Supplier: LCSC; Tolerance: ±20%; Rated Voltage: 10V; Ripple Current: 110mA@120Hz; φD: 6.3mm; L: 7.7mm; Lifetime @ Temp: 2000hrs@105℃; Operating Temperature: -55℃~+105℃
J11 J12 = PJ-307N5: 连接器类型:3.5mm耳机座;额定电流:500mA;额定电压:30V;工作温度范围:-20℃~+70℃;焊接温度(最大值):235℃;; LCSC Part Name: 3.5mm耳机座; Supplier Part: C692542; Manufacturer: XKB Connection(中国星坤); Supplier Footprint: 插件; JLCPCB Part Class: 扩展库; Datasheet: https://atta.szlcsc.com/upload/public/pdf/source/20211011/F66D919C7AD2165D165DDB41FD7BE51E.pdf; Supplier: LCSC; Connector Type: 3.5mm耳机座; Current Rating (Max): 500mA; Voltage Rating (Max): 30V; Operating Temperature Range: -20℃~+70℃; Soldering Temperature(Max): 235℃
JP1 = 跳帽: 短接跳帽
MIC = BX-XH2.54-2PZZ: 插针结构:1x2P;间距:2.54mm;安装方式:直插;参考系列:XH;总PIN数:2P;排数:1;每排PIN数:2;行距:-;额定电流:3A;触头材质:黄铜;触头镀层:锡;工作温度范围:-25℃~+85℃;; Supplier Part: C18077833; Manufacturer: Bossie(博锡); Supplier Footprint: 插件,P=2.54mm; Datasheet: https://atta.szlcsc.com/upload/public/pdf/source/20231017/CB25E46A13930659CD6CDE2F2553A508.pdf; Supplier: LCSC; Pins Structure: 1x2P; Pitch: 2.54mm; Mounting Style: 直插; Reference Series: XH; Number of Pins: 2P; Number of Rows: 1; Number of PINs Per Row: 2; Current Rating (Max): 3A; Contact Material: 黄铜; Contact Plating: 锡; Operating Temperature Range: -25℃~+85℃
R126 = 0603WAF3001T5E: 电阻类型:厚膜电阻;阻值:3kΩ;精度:±1%;功率:100mW;最大工作电压:75V;温度系数:±100ppm/℃;; LCSC Part Name: 3kΩ ±1% 100mW 厚膜电阻; Supplier Part: C4211; Manufacturer: UNI-ROYAL(厚声); Supplier Footprint: 0603; JLCPCB Part Class: 基础库; Datasheet: https://atta.szlcsc.com/upload/public/pdf/source/20200306/C422600_1E6D84923E4A46A82E41ADD87F860B5C.pdf; Supplier: LCSC; Type: 厚膜电阻; Tolerance: ±1%; Power(Watts): 100mW; Overload Voltage (Max): 75V; Temperature Coefficient: ±100ppm/℃; Operating Temperature Range: -55℃~+155℃
R130 = 0603WAF5102T5E: 电阻类型:厚膜电阻;阻值:51kΩ;精度:±1%;功率:100mW;最大工作电压:75V;温度系数:±100ppm/℃;; LCSC Part Name: 51kΩ ±1% 100mW 厚膜电阻; Supplier Part: C23196; Manufacturer: UNI-ROYAL(厚声); Supplier Footprint: 0603; JLCPCB Part Class: 基础库; Datasheet: https://atta.szlcsc.com/upload/public/pdf/source/20200306/C422600_1E6D84923E4A46A82E41ADD87F860B5C.pdf; Supplier: LCSC; Type: 厚膜电阻; Tolerance: ±1%; Power(Watts): 100mW; Overload Voltage (Max): 75V; Temperature Coefficient: ±100ppm/℃; Operating Temperature Range: -55℃~+155℃
R132 R133 = 0603WAF6802T5E: 电阻类型:厚膜电阻;阻值:68kΩ;精度:±1%;功率:100mW;最大工作电压:75V;温度系数:±100ppm/℃;; LCSC Part Name: 68kΩ ±1% 100mW 厚膜电阻; Supplier Part: C23231; Manufacturer: UNI-ROYAL(厚声); Supplier Footprint: 0603; JLCPCB Part Class: 基础库; Datasheet: https://atta.szlcsc.com/upload/public/pdf/source/20200306/C422600_1E6D84923E4A46A82E41ADD87F860B5C.pdf; Supplier: LCSC; Type: 厚膜电阻; Tolerance: ±1%; Power(Watts): 100mW; Overload Voltage (Max): 75V; Temperature Coefficient: ±100ppm/℃; Operating Temperature Range: -55℃~+155℃
U13 = LMV358ARZ: 放大器数:双路;; Supplier Part: C2928823; Manufacturer: HTCSEMI(海天芯); Supplier Footprint: SOP-8; JLCPCB Part Class: 扩展库; Datasheet: https://atta.szlcsc.com/upload/public/pdf/source/20220114/2D4B849A76DE33264688A93B3A90A0F8.pdf; Supplier: LCSC; Number of Circuits: 双路
U14 = TLV320AIC23BIPWR: 接口:串行;; Supplier Part: C2863535; Manufacturer: TI(德州仪器); Supplier Footprint: TSSOP-28; JLCPCB Part Class: 扩展库; Datasheet: https://www.ti.com/cn/lit/gpn/tlv320aic23b; Supplier: LCSC; Interface: 串行; Operating Temperature: -40℃~+85℃

## Nets
AGND: C31.1 C35.1 C37.1 C38.2 C39.2 C40.1 C41.2 C42.1 C43.2 C44.1 C45.2 C46.1 C47.2 C79.2 C86.1 J11.1 J12.1 JP1.2 MIC.2 R128.2 R129.1 R135.2 R136.2 R138.2 R140.2 U13.4(GND) U14.11(HPGND) U14.15(AGND) U14.21(CS#) U14.22(MODE) U14.28(DGND)
GND: C7.1 C15.2 C16.1 C17.1 C18.2 C19.1 C20.2 C21.1 C22.2 C24.2 C25.1 C26.2 C27.2 C28.1 C29.2 C30.1 C52.2 C78.2 C80.1 C85.1 J7.24(GND) J8.1 J8.20 J9.1 J9B.1 J13.6(VSS) J13.10(GND) J13.11(GND) J13.12(GND) J13.13(GND) JP1.1 Q1.2(E) Q4.2(E) R51.1 R67.2 R120.1 R179.1 R183.1 T1.1(GND) U4.2(GND) U6.4(GND) U7.1(A0) U7.2(A1) U7.3(A2) U7.4(GND) U7.7(WP) U8.1(OE#) U8.10(GND) U9.14(GND) U10.8(GND) U10.13(G#) U11.8(GND) U11.13(G#) W2.1 ; also on sheet 1 2 6
COM0: LED4_A.12(DIG1) U10.15(QA)
COM1: LED4_A.9(DIG2) U10.1(QB)
COM2: LED4_A.8(DIG3) U10.2(QC)
COM3: LED4_A.6(DIG4) U10.3(QD)
COM4: LED4_B.12(DIG1) U10.4(QE)
COM5: LED4_B.9(DIG2) U10.5(QF)
COM6: LED4_B.8(DIG3) U10.6(QG)
COM7: LED4_B.6(DIG4) U10.7(QH)
DATA2: U10.9(Q′H) U11.14(SER)
HPLO: C48.1 U14.9(LHPOUT)
HPRO: C49.1 U14.10(RHPOUT)
J1A-1: J1.1 ; also on sheet 6
J1A-2: J1.2 ; also on sheet 6
J1B-1: J1.4 J7.13(LCD_D3) J8.10 U9.23(A11) ; also on sheet 1
J1B-2: J1.3 ; also on sheet 6
J1C-1: J1.6 U14.23(SDIN) ; also on sheet 1
J1C-2: J1.5 R3.2
J3-23: J7.22(LCD_RD) R91.1 R98.2
J3-24: J7.21(LCD_WR) R83.2 R92.1
J3-25: J7.20(LCD_RS) R93.1 R100.2
J3-26: J7.19(LCD_CS) R94.1 R101.2
J3-27: J7.18(LCD_RST) R95.1
J18A-2: U6.6(CLK) ; also on sheet 1 2
J18B-2: U6.2(DO) ; also on sheet 1 2
J18C-2: J8.5 R92.2 U9.27(WE#) ; also on sheet 1 2
J18D-2: J8.6 R91.2 U9.22(OE#) ; also on sheet 1 2
LED_A: LED4_A.11(A) LED4_B.11(A) R70.2
LED_B: LED4_A.7(B) LED4_B.7(B) R71.2
LED_C: LED4_A.4(C) LED4_B.4(C) R72.2
LED_D: LED4_A.2(D) LED4_B.2(D) R73.2
LED_E: LED4_A.1(E) LED4_B.1(E) R74.2
LED_F: LED4_A.10(F) LED4_B.10(F) R75.2
LED_G: LED4_A.5(G) LED4_B.5(G) R76.2
LED_H: LED4_A.3(DP) LED4_B.3(DP) R77.2
P0.0: R6.2 R42.2 U8.2(1D) U9.11(I/O0) ; also on sheet 1 6
P0.1: R7.2 R22.2 U8.3(2D) U9.12(I/O1) ; also on sheet 1 6
P0.2: R8.2 R44.2 U8.4(3D) U9.13(I/O2) ; also on sheet 1 6
P0.3: R9.2 R23.2 U8.5(4D) U9.15(I/O3) ; also on sheet 1
P0.4: R10.2 R100.1 U8.6(5D) U9.16(I/O4) ; also on sheet 1
P0.5: R11.2 R101.1 U8.7(6D) U9.17(I/O5) ; also on sheet 1
P0.6: R12.2 R46.2 U8.8(7D) U9.18(I/O6) ; also on sheet 1
P0.7: R13.2 R47.2 U8.9(8D) U9.19(I/O7) ; also on sheet 1 6
P1.1: J9.6 ; also on sheet 1 6
P1.2: C38.1 R134.1 ; also on sheet 1
P1.4: R81.2 R98.1 U14.5(LRCIN) ; also on sheet 1
P1.5: R80.2 R83.1 U14.4(DIN) ; also on sheet 1
P1.6: U14.25(XTI/MCLK) ; also on sheet 1
P1.7: U14.3(BCLK) ; also on sheet 1
P2.0: J7.8(LCD_D0) J8.7 U9.25(A8) ; also on sheet 1
P2.1: J7.7(LCD_D1) J8.8 U9.24(A9) ; also on sheet 1
P2.2: J7.14(LCD_D2) J8.9 U9.21(A10) ; also on sheet 1
P2.4: J7.12(LCD_D4) J8.11 J13.2(CD/DAT3) U9.2(A12) ; also on sheet 1
P2.5: J7.11(LCD_D5) J8.12 J13.3(CMD) U9.26(A13) ; also on sheet 1
P2.6: J7.10(LCD_D6) J8.13 J13.7(DAT0) U9.1(A14) ; also on sheet 1
P2.7: J7.9(LCD_D7) J8.14 J13.5(CLK) J17.1 ; also on sheet 1
P3.2: J7.3(SD_SCK) J9.3 J9B.3 U7.6(SCL) U10.11(SCK) U11.11(SCK) ; also on sheet 1
P3.3: J7.4(SD_DO) J9.4 J9B.4 J10.1 U7.5(SDA) ; also on sheet 1
P3.4: J7.5(SD_DI) U10.14(SER) ; also on sheet 1
P3.5: J9.7 U4.1(OUT) U10.12(RCK) U11.12(RCK) ; also on sheet 1
P4.0: R5.2 U6.1(CS#) ; also on sheet 1
P4.1: U6.5(DI) U9.20(CE#) ; also on sheet 1
P4.5-ALE: J8.4 R93.2 U8.11(LE) ; also on sheet 1
P4.7: J8.17 J9.5 R95.2 ; also on sheet 1
P5.1: U14.24(SCLK) ; also on sheet 1 6
P5.2: U6.3(WP#) ; also on sheet 1
P5.3: R94.2 U6.7(HOLD#) ; also on sheet 1
P10-ADC-KEY: C24.1 R50.2 ; also on sheet 1
Q0: U8.19(1Q) U9.10(A0)
Q1: U8.18(2Q) U9.9(A1)
Q2: U8.17(3Q) U9.8(A2)
Q3: U8.16(4Q) U9.7(A3)
Q4: U8.15(5Q) U9.6(A4)
Q5: U8.14(6Q) U9.5(A5)
Q6: U8.13(7Q) U9.4(A6)
Q7: U8.12(8Q) U9.3(A7)
QA: R70.1 U11.15(QA)
SYS-VCC: C7.2 C17.2 C18.1 C19.2 C20.1 C21.2 C22.1 C25.2 C26.1 C27.1 C28.2 C39.1 C40.2 C41.1 C44.2 C45.1 C46.2 C47.1 C52.1 C78.1 C80.2 C85.2 C86.2 J7.27(3V3) J8.2 J9.2 J9.8 J9B.2 J13.4(VDD) KEY_F.2 Q2.2(E) R4.2 R28.2 R48.2 R49.2 R52.1 R68.1 R69.1 R82.2 R121.1 R176.1 R180.2 T1.3(VDD) U6.8(VCC) U7.8(VCC) U8.20(VCC) U9.28(VDD) U10.16(VCC) U11.16(VCC) U13.8(VCC) U14.1(BVDD) U14.8(HPVDD) U14.14(AVDD) U14.27(DVDD) ; also on sheet 2 6
TP_IRQ: J7.2(NC) R81.1
TP_SS: J7.6(SD_SS) R80.1
USB+5V: C15.1 R27.2 R175.1 ; also on sheet 1 2
$3N1172: C179.1 R179.2
$3N1869: C16.2 R28.1 U4.3(VCC)
$3N2001: LED9.2(C) Q4.3(C)
$3N2003: Q4.1(B) R26.1
$3N2042: LED9.1(A) R27.1
$3N4217: K0_2.2 K1_2.2 R44.1
$3N4218: K1_0.1 K1_1.1 K1_2.1 K1_3.1 R47.1 R49.1
$3N4219: K0_0.1 K0_1.1 K0_2.1 K0_3.1 R46.1 R48.1
$3N4220: K0_1.2 K1_1.2 R22.1
$3N4221: K0_3.2 K1_3.2 R23.1
$3N4222: K0_0.2 K1_0.2 R42.1
$3N5698: KEY0.1 KEY1.1 KEY2.1 KEY3.1 KEY4.1 KEY5.1 KEY6.1 KEY7.1 KEY8.1 KEY9.1 KEY_A.1 KEY_B.1 KEY_C.1 KEY_D.1 KEY_E.1 KEY_F.1 R50.1 R51.2
$3N5699: KEY3.2 R63.2 R64.1
$3N5707: KEY9.2 R57.2 R58.1
$3N6826: KEY_E.2 R52.2 R53.1
$3N6865: KEY_D.2 R53.2 R54.1
$3N6904: KEY_C.2 R54.2 R55.1
$3N6943: KEY_B.2 R55.2 R56.1
$3N7019: KEY_A.2 R56.2 R57.1
$3N7243: KEY4.2 R62.2 R63.1
$3N7245: KEY5.2 R61.2 R62.1
$3N7247: KEY6.2 R60.2 R61.1
$3N7249: KEY7.2 R59.2 R60.1
$3N7251: KEY8.2 R58.2 R59.1
$3N7401: KEY0.2 R66.2 R67.1
$3N7403: KEY1.2 R65.2 R66.1
$3N7405: KEY2.2 R64.2 R65.1
$3N9127: R71.1 U11.1(QB)
$3N9128: R72.1 U11.2(QC)
$3N9174: R68.2 U10.10(SCLR#)
$3N9215: R76.1 U11.6(QG)
$3N9216: R77.1 U11.7(QH)
$3N9217: R73.1 U11.3(QD)
$3N9218: R74.1 U11.4(QE)
$3N9219: R75.1 U11.5(QF)
$3N9751: R69.2 U11.10(SCLR#)
$3N36119: LED01.1(K) R7.1
$3N36124: LED00.1(K) R6.1
$3N36126: BEEP1.2 D2.2(A) Q1.3(C)
$3N36127: BEEP1.1(+) D2.1(K) R4.1
$3N36130: Q1.1(B) R3.1
$3N36136: LED07.1(K) R13.1
$3N36137: LED06.1(K) R12.1
$3N36138: LED00.2(A) LED01.2(A) LED02.2(A) LED03.2(A) LED04.2(A) LED05.2(A) LED06.2(A) LED07.2(A) Q2.3(C)
$3N36139: LED05.1(K) R11.1
$3N36140: LED04.1(K) R10.1
$3N36141: LED03.1(K) R9.1
$3N36143: Q2.1(B) R5.1
$3N36158: LED02.1(K) R8.1
$3N36301: J17.2 R26.2
$3N36360: C179.2 J10.2 R180.1 T1.2(DQ)
$4N1530: C29.1 C30.2 J8.19 R175.2 R176.2 W2.3
$4N1533: J8.16 R120.2
$4N1555: J8.3 W2.2
$4N1755: J8.15 R121.2 R183.2
$5N2168: C50.2 R137.1 R138.1
$5N2173: C51.1 U14.13(ROUT)
$5N2174: C50.1 U14.12(LOUT)
$5N2176: C51.2 R139.1 R140.1
$5N2187: C49.2 J11.3 R136.1
$5N2188: C48.2 J11.2 R135.1
$5N2203: J12.3 R139.2
$5N2204: J12.2 R137.2
$5N2309: C79.1 R82.1 R126.2 R127.2
$5N2441: C31.2 C32.2 MIC.1 R126.1
$5N2693: C32.1 R127.1 R128.1 U13.5(IN2+)
$5N2810: C33.1 R129.2
$5N2975: C33.2 C34.2 R130.2 U13.6(IN2-)
$5N2994: C34.1 R130.1 R131.1 U13.7(OUT2)
$5N3234: C35.2 R131.2 R132.2
$5N3261: C36.2 R132.1 R133.2
$5N3331: C37.2 R133.1 U13.3(IN1+)
$5N3478: C36.1 R134.2 R182.1 U13.1(OUT)
$5N3573: R182.2 U13.2(IN1-)
$5N4359: C42.2 C43.1 U14.16(VMID)

Not connected (* = marked no-connect by the designer): J7 1(NC)* 15(NC)* 16(NC)* 17(NC)* 23(NC)* 25(NC)* 26(5V)* 28(NC)*; J8 18*; J11 4* 5*; J12 4* 5*; J13 1(DAT2)* 8(DAT1)* 9(CD)*; U11 9(Q′H)*; U14 2(CLKOUT)* 6(DOUT)* 7(LRCOUT)* 17(MICBIAS)* 18(MICIN)* 19(RLINEIN)* 20(LLINEIN)* 26(XTO)*

## Notes on the sheets
sheet 3
- STC大学计划实验箱 AI8051U V1.2.2 原理图  3/6
- www.STCAI.com
- 2024-8-29
- 板载外设电路
- 595_SCK
  595_SER
  595_RCK
- P3.2
  P3.3
  P3.4
  P3.5
- SCLK_4/SCL_4
  MISO_4/SDA_4
  MOSI_4
  SS_4
- 共阴极正常用例程代码
  共阳极注意例程里面对段码取"~"
- IR_RX
- PIN1 --GND，官版V1.2的封装
  私有，选封装时注意核对
- 注意原版V1.2略有差异↘
- 使用彩屏接口时需要禁止
  红外发射，否则影响彩屏显示
- 红外接收
- 74HC595
- R70~R77
  300R*8 0603
- LED4_HSA
- LED4_HSA
- IR_LED
- 红外发射
- ↖若NC，则需要打开内部上拉电阻
- IR_TX
- IR_RX
- DS18B20-DQ
- 红外发射开关
  跳线帽连接J17两脚：允许红外发射
  跳线帽只插在J17的一只脚：禁止红外发射
- test & normal not fited
- 74HC595
- 矩阵式键盘，可用扫描法识别按键
- QSPI或普通SPI串行总线接口
- 8个独立LED指示灯实验
- /W2502S6JV
- LED_PWR
- SPI_SS_3
- QSPINCS_2
- SPI_MISO_3
- QSPIIO1_2
- QSPIIO3_2
- R6~R13
  3.3K
- QSPIIO2_2
- QSPICLK_2
- SPI_SCLK_3
- SCL_4
- QSPIIO0_2
- SPI_MOSI_3
- SDA_4
- 需要打开内部上拉电阻
  如果MCU内部没有上拉电阻，需要外接上拉电阻
- （24C02/04/08/16/32/64/128/256）
- RED
- 需要打开内部上拉电阻
- 如果使用单片机片外总线就不要使用上图的P0口行列矩阵按键扫描电路
  改用下图的ADC按键检测电路
- RED
- RED
- 读ADC键方法:
- TF卡插座
- 每隔10ms左右读一次ADC值,并且保存最后3次的读数,其变化比较小时再判断键.
  判断键有效时, 允许一定的偏差, 比如正负16个字的偏差.
- TF(SD)卡与FLASH芯片占用SPI的引脚分开
  (V1.1公用，V1.2分开)
- RED
- RED
- 16个ADC按键
- 12位
  ADC值
- SPI_SS_2
- RED
- SPI_MOSI_2
- SPI_SCLK_2
- RED
- 4095
- 2560
- 1024
- SPI_MISO_2
- RED
- 3840
- 2304
- 768
- SD_MICRO1
- 3584
- 2048
- 512
- 3328
- 1792
- 256
- 3072
- 1536
- P4.1为高时 U9 SRAM 处于非选中状态，
  这时 SRAM接到单片机的所有端口处于高阻输入状态，
  不影响单片机的 I/O 口正常工作
- P2[0: 7] -- A[0: 7]
- 外部并行总线扩展32K SRAM
- 2816
- 1280
- BEEP
- P0[0: 7] -- AD[0: 7]
- (WR)
- SRAM_WR
- 蜂鸣器开关
  跳线帽连接J1C两脚：开蜂鸣器
  跳线帽只插在J1C的一只脚：关蜂鸣器
- SRAM_RD
- SRAM_CE
- 573_LE
- 74HC573-SOP20
- IS62C256AL_SOP28
- RW_S[1: 0] = 01
- P3.6  =  WR
  P3.7  =  RD
sheet 4
- STC大学计划实验箱 AI8051U V1.2.2 原理图  4/6
- www.STCAI.com
- 2024-8-29
- OLED/LCD/TFT显示电路
- 彩屏接口与LCD12864模块不能同时使用
- P1.5
- TP_SS
- P3.4
- TP_DI
- MOSI_4
- P2 BUS -- LCD-DB[0: 7]
- P3.3
- TP_DO
- MISO_4
- 所有需要加上拉电阻的I/O口，
  需先将内部的4K上拉电阻打开
- 接口信号定义
- LCD12864
- NC
- P3.2
- TP_SCK
- SCLK_4
- P1.4
- TP_IRQ
- K
- P3.7
- LCD_RD
- NC/VOUT
- A
- P3.6
- LCD_WR
- /RST
- 数据/命令
- P4.5
- LCD_RS
- NC
- 1：并行
  0：串行
- P5.3
- LCD_CS
- PSB
- P4.7
- LCD_RST
- R98~R99
- 默认NC
- DB7
- DB6
- R91~R95
  100R*5 0603
- R98~R99
  100R*2 0603
- DB4
- DB5
- PIN1
- DB3
- 官版V1.2  2.4inch TFT
  引脚部分说明
- DB2
- DB1
- PIN28
- R80~R81
  100R*2 0603
- DB0
- R100~R101
  100R*2 0603
- R/W
- E
- RS
- R94 默认NC
- VO
- VCC
- GND
- R120 是为了与 LCD1602 屏兼容
  增加的电阻，出厂时不焊。
- 使用IIC接口屏时设置为P3.2=SCL_4、P3.3=SDA_4
  使用SPI接口屏时设置为P3.3=MOSI_4、P3.4=MISO_4
  MOSI_4、MISO_4可以互换设置，请参考数据手册
  彩屏脚间距2.54mm，实验箱板上最大可插1.3吋彩屏
- OLED显示屏
  SPI/I2C 8/7线接口
- OLED显示屏
  I2C 4线接口
- 电源地
- 电源正
- 时钟线
- SCLK/SCL
- SCL
- 数据线
- MOSI/SDA
- SDA
- 屏幕复位
- RES
- 数据/命令
- DC
- 片选
- 背光
- 默认开
- BLK
- CS
- 8-Pin SPI/IIC TFT
- 显示屏插座可插7线或8线的OLED显示屏。
  两者管脚兼容，7线的少了BLK脚
sheet 5
- STC大学计划实验箱 AI8051U V1.2.2  原理图  5/6
- www.STCAI.com
- 2024-8-29
- 音频外设电路
- 话筒放大电路，用于数字录音。
- 注意原版V1.2略有差异↘
- 这一级应该是要做驱动跟随的，理论上PIN2不可以浮空要短接输出
- 3阶巴特沃斯低通滤波器 fc = 7400Hz，其它截止频率请按比例调整C64、C65、C66的值，电阻值不变。
- MIC_IN
- 线路输出+电子音量+耳机放大输出
- 接口要求：
  1、I2S接口安排在P1.4、P1.5、P1.6、P1.7。
  2、咪头信号ADC接到任意一个ADC输入均可，建议安排在P0.0~P0.6任意一个。
  4、TLV320AIC23B的控制脚TLV-SCL、TLV-SDA可以安排在任意IO。
  注意：TF(SD)卡、FLASH芯片、TLV320AC23B均须用3.3V供电，所以 STC8051H/U 也要用3.3V供电。
  本电路使用的IO口为独占，不要复用为其余功能
- 立体声耳机输出
- I2S_S[1: 0] = 01
- I2SCK_2
- 一点接地
- 注意这里所选型号的封装绘制，
  和孔位是非顺序的，
  会与原版原理图有区别。
  这里用的
  C692542
- I2SSD_2
- I2MCK_2
- 改动：推荐最终使用直连焊接替代0R,因为0Ω电阻也只是→0Ω，
  这里设置跳线焊盘，用来后续可以有对比效果的实验
- I2SWS_2
- TLV320_SCLK
- TLV320_SDIN
- MODE = 0,
  使用I2C接口
- 默认片选
- 立体声线路输出
